# Altium project PCB_Project.PrjPcb
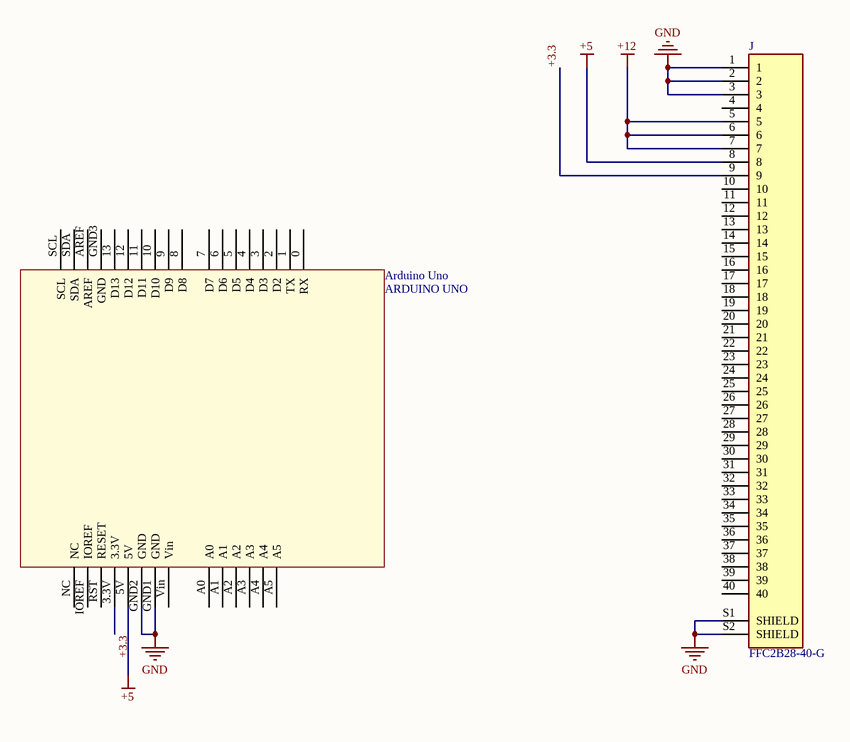
[diagram p0: Sheet1.SchDoc]
1 sheet, 2 parts. Net scope: global (net labels, ports and power ports of the same name join across sheets).
Board file: PCB1.PcbDoc

## Sheet Sheet1.SchDoc
size A4

### Parts
Arduino_Uno  ARDUINO UNO  [ARDUINO UNO]
J  FFC2B28-40-G  [GCT_FFC2B28-40-G]

### Nets
+5: Arduino_Uno.5V J.8
+12: J.5 J.6 J.7
GND: Arduino_Uno.GND1(GND) Arduino_Uno.GND2(GND) J.1 J.2 J.3 J.S1(SHIELD) J.S2(SHIELD)
+3.3: Arduino_Uno.3.3V J.9

Not connected (* = marked no-connect by the designer): Arduino_Uno 0(RX) 1(TX) 2(D2) 3(D3) 4(D4) 5(D5) 6(D6) 7(D7) 8(D8) 9(D9) 10(D10) 11(D11) 12(D12) 13(D13) A0 A1 A2 A3 A4 A5 AREF GND3(GND) IOREF NC RST(RESET) SCL SDA Vin; J 4 10 11 12 13 14 15 16 17 18 19 20 21 22 23 24 25 26 27 28 29 30 31 32 33 34 35 36 37 38 39 40

### Library data of the parts
J = FFC2B28-40-G: 40 Position FFC, FPC Connector Contacts, Top and Bottom 0.020 _0.50mm_ Surface Mount, Right Angle; MF: Global Connector Technology; Value: *; MP: FFC2B28-40-G; Package: Package Analog Devices; Price: None; Availability: Unavailable; SnapEDA_Link: https://www.snapeda.com/parts/FFC2B28-40-G/Global%20Connector%20Technology/view-part/4223068/?ref=snap